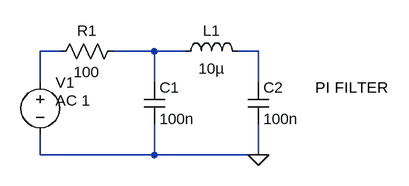
[diagram p0: schematic pi_filter_2022023.asc]
pi_filter_2022023.asc, the LTspice schematic file:
Version 4
SHEET 1 880 680
WIRE -48 80 -80 80
WIRE 96 80 32 80
WIRE 144 80 96 80
WIRE 256 80 224 80
WIRE -80 128 -80 80
WIRE 96 128 96 80
WIRE 256 128 256 80
WIRE -80 240 -80 208
WIRE 96 240 96 192
WIRE 96 240 -80 240
WIRE 256 240 256 192
WIRE 256 240 96 240
FLAG 256 240 0
SYMBOL cap 80 128 R0
SYMATTR InstName C1
SYMATTR Value 100n
SYMBOL cap 240 128 R0
SYMATTR InstName C2
SYMATTR Value 100n
SYMBOL ind 128 96 R270
WINDOW 0 32 56 VTop 2
WINDOW 3 5 56 VBottom 2
SYMATTR InstName L1
SYMATTR Value 10µ
SYMBOL voltage -80 112 R0
WINDOW 123 24 44 Left 2
WINDOW 39 0 0 Left 0
WINDOW 3 24 44 Left 2
SYMATTR Value2 AC 1
SYMATTR Value ""
SYMATTR InstName V1
SYMBOL res 48 64 R90
WINDOW 0 0 56 VBottom 2
WINDOW 3 32 56 VTop 2
SYMATTR InstName R1
SYMATTR Value 100
TEXT 344 136 Left 2 !PI FILTER

The netlist it stands for:
* pi_filter_2022023.asc
C1 N002 0 100n
C2 N003 0 100n
L1 N002 N003 10µ
V1 N001 0 AC 1
R1 N002 N001 100
PI FILTER
.backanno
.end